# Altium schematic sheet Main.SchDoc
size B; SheetNumber: 3; SheetTotal: 3
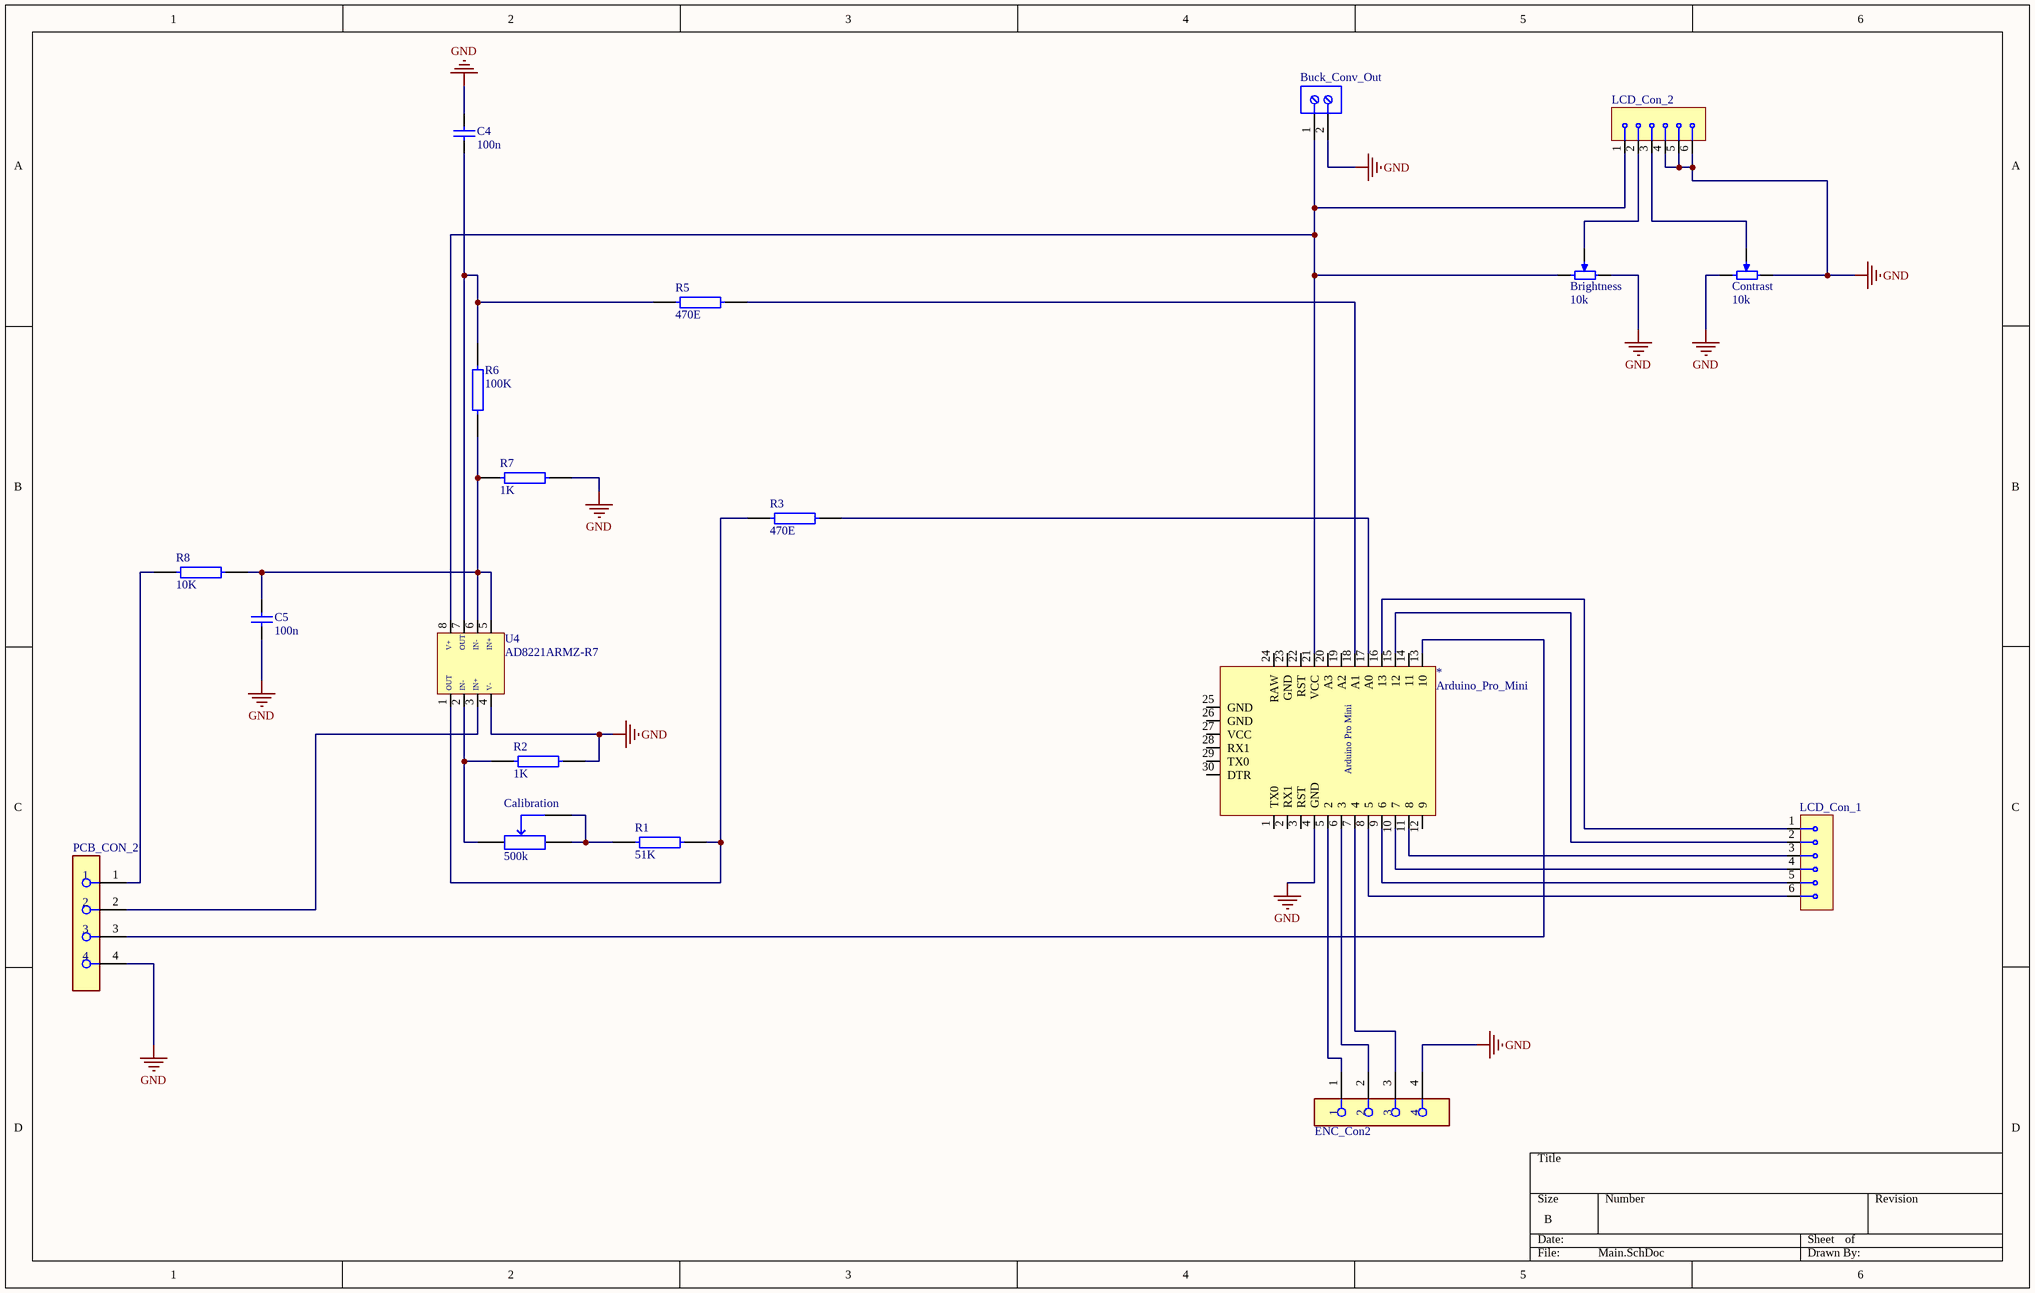
[diagram p0: Main.SchDoc]

## Parts
*  Arduino_Pro_Mini  [Arduino_Mini_Pro]
Brightness  10k  [10k_Trim_Pot]
Buck_Conv_Out  (no value)  [screw_terminal]
C4  100n  [Capacitor_Monolitoc]
C5  100n  [Capacitor_Monolitoc]
Calibration  500k  [500k_Trim_Pot]
Contrast  10k  [10k_Trim_Pot]
ENC_Con2  (no value)  [Header-Female-JST_4pin]
LCD_Con_1  (no value)  [6Pin_Connector]
LCD_Con_2  (no value)  [6Pin_Connector]
PCB_CON_2  (no value)  [Header-Female-JST_4pin]
R1  51K  [Resistor]
R2  1K  [Resistor]
R3  470E  [Resistor]
R5  470E  [Resistor]
R6  100K  [Resistor]
R7  1K  [Resistor]
R8  10K  [Resistor]
U4  AD8221ARMZ-R7  [DIP8_AD822]

## Nets
GND: *.4(GND) Brightness.1(CCW) Buck_Conv_Out.2 C4.2 C5.1 Contrast.1(CCW) Contrast.3(CW) ENC_Con2.4 LCD_Con_2.4 LCD_Con_2.5 LCD_Con_2.6 PCB_CON_2.4 R2.2 R7.2 U4.4
Net*_5: *.5(2) ENC_Con2.1
Net*_6: *.6(3) ENC_Con2.2
Net*_7: *.7(4) ENC_Con2.3
Net*_8: *.8(5) LCD_Con_1.6
Net*_9: *.9(6) LCD_Con_1.5
Net*_10: *.10(7) LCD_Con_1.4
Net*_11: *.11(8) LCD_Con_1.3
Net*_13: *.13(10) PCB_CON_2.3
Net*_15: *.15(12) LCD_Con_1.2
Net*_16: *.16(13) LCD_Con_1.1
Net*_17: *.17(A0) R3.2
Net*_18: *.18(A1) R5.2
Net*_21: *.21(VCC) Brightness.3(CW) Buck_Conv_Out.1 LCD_Con_2.1 U4.8
NetBrightness_2: Brightness.2(S) LCD_Con_2.2
NetC4_1: C4.1 R5.1 R6.2 U4.7
NetC5_2: C5.2 R6.1 R7.1 R8.2 U4.5 U4.6
NetCalibration_1: Calibration.1(CCW) Calibration.2(WIPER) R1.1
NetCalibration_3: Calibration.3(CW) R2.1 U4.2
NetContrast_2: Contrast.2(S) LCD_Con_2.3
NetPCB_CON_2_1: PCB_CON_2.1 R8.1
NetPCB_CON_2_2: PCB_CON_2.2 U4.3
NetR1_2: R1.2 R3.1 U4.1

Not connected (* = marked no-connect by the designer): * 1(TX0) 2(RX1) 3(RST) 12(9) 14(11) 19(A2) 20(A3) 22(RST) 23(GND) 24(RAW) 25(GND) 26(GND) 27(VCC) 28(RX1) 29(TX0) 30(DTR)

## Notes on the sheet
- (in symbol Arduino_Pro_Mini) Arduino Pro Mini
- (in symbol OP_AMP_AD822) V+; OUT; IN-; IN+; V-

## Library data of the parts
Brightness Contrast = 10k_Trim_Pot: Voltage Rating: 220 mV; Power Rating: 1 W; Tolerance: 1%; Resistance: 50 mohm; Case/Package: 1206; Length: 3.2 mm; RoHSCompliant: True; PackageDescription: 3-Pin Through Hole Device, Body 6.6 x 6.99 mm, Pitch 2.54 mm; ComponentLink2Description: Datasheet; REACH SVHC: No SVHC; Mount: Surface Mount; Height: 0.6 mm; Packaging: Tape and Reel; ComponentLink1URL: http://www.bourns.com/; Case Code (Imperial): 0612; Pins: 2; Case Code (Metric): 1632; ComponentLink2URL: http://www.bourns.com/docs/Product-Datasheets/3362.pdf; Min Operating Temperature: -25degC; ComponentLink1Description: Manufacturer URL; PackageReference: 3326P; Max Operating Temperature: 125degC; Width: 1.6 mm; Package Quantity: 5000; DatasheetVersion: May-16
Buck_Conv_Out = Screw_Terminal: NexarPartId: 18818288; Plating: Brass, Steel; Current: 10A; Pitch: 3.5052mm; Number of Levels: 1; Number of Contacts: 2; Wire Gauge (Min): 16AWG; Voltage: 300V; Wire Gauge (Max): 24AWG; Stripping Length: -6mm; Number of Pins: 2; Number of Rows: 1; REACH SVHC: Unknown; RoHS: Compliant; Housing Material: Nylon; Termination: Screw; Mount: Through Hole; Contact Plating: Brass, Tin; Number of Positions Per Level: 2; Color: Blue, Green; Width: 7.9mm; Voltage Rating: 300V; Length: 7.4mm; Current Rating: 10A; Wire/Cable Gauge: 24AWG; Packaging: Box; Max Operating Temperature: 105°C; Lead Pitch: 3.5mm; Height: 8.7mm; Contact Material: Brass; Min Operating Temperature: -40°C
C4 C5 = Capacitor_Monolitic: Manufacturer: Murata; Packaging type: Bulk; CS: 5mm; Tolerance: 10%; Capacity (elec.): 10nF; Material: Ceramic; Type: radiallead; Industrial packaging: Yes; Nominal voltage: 1000V; Content: 500pc(s); Category: Ceramiccapacitor; Datasheet Version: 06/2016; Package Reference: DEBF33A103ZA2B; Mounting Technology: ThroughHole; Package Description: 2-Pin Through Hole Device, Body 4 x 10 mm, Pitch 5 mm; Datasheet URL: http://psearch.en.murata.com/capacitor/product/DEBF33A103ZA2B.pdf; Manufacturer URL: http://www.murata.com/
Calibration = 500k_Trim_Pot: TRIMMER 500K OHM 0.5W PC PIN TOP; Manufacturer: Bourns; Manufacturer Part Number: 3296W-1-504LF; Resistance: 500kΩ; Temperature Coefficient: 100ppm/°C; Value: 500kΩ; Tolerance: 10%; Voltage Rating: 300V; Standoff Height: 0.38mm; ComponentLink2Description: Datasheet; Package: 3296W; Series: Trimpot 3296-Sealed; Lead Free: Yes; Octopart: https://octopart.com/3296w-1-504lf-bourns-143884; Device Class L2: Resistors; Automotive: No; RoHS: TRUE; Temperature Range High: +125°C; Height: 12.05mm; Power Rating: 0.5W; Temperature Range Low: -55°C; ComponentLink2URL: https://www.bourns.com/docs/Product-Datasheets/3296.pdf; Device Class L1: Passive Components; Device Class L3: Variable Resistors and Potentiometers; Category: Res; Temperature: -55°C to +125°C; Digikey Description: TRIMMER 500K OHM 0.5W PC PIN TOP; Mouser Description: Trimmer; Cermet; Rest 500 Kilohms; PCB; 25 Turns; Pwr-Rtg 0.5W
ENC_Con2 PCB_CON_2 = Header-Female-JST_4pin: Contact Resistance: 10mR; Number of Positions: 4; Pitch: 2.54mm; Gender: Female; Connector Type: Receptacle; Max Current Rating: 1A; Color: Black; Contact Material: Copper; Min Operating Temperature: -55°C; Max Operating Temperature: 125°C; Radiation Hardening: No; Termination: Solder; Depth: 2.54mm; Contact Plating: Gold; Orientation: Straight; Housing Color: Black; Width: 2.54mm; RoHS Compliant: Yes; Lead Free: Lead Free; Mount: Through Hole; Series: SS; Length: 10.16mm; Packaging: Bulk; Package Quantity: 1; Housing Material: Polyester; Number of Contacts: 4; Number of Rows: 1
LCD_Con_1 LCD_Con_2 = 6Pin_Connector
R1-R3 R5-R8 = Resistor: NexarPartId: 44386654; Tolerance: 1%; Max Power Dissipation: 250mW; Voltage Rating: 200V; Power Rating: 125mW; Temperature Coefficient: 50ppm/°C; Resistance: 73.2kΩ; Width: 1.65mm; Length: 3.81mm; Schedule B: 8533210090, 8533210090|8533210090|8533210090|8533210090|8533210090; Termination: Axial; Lead Free: Lead Free; Diameter: 1.65mm; Voltage Rating (DC): 200V; Packaging: Cut Tape; Max Operating Temperature: 175°C; Composition: Metal Film; RoHS: Compliant; Mount: Through Hole; Features: Flame Retardant Coating, Moisture Resistant; Number of Terminations: 2; Min Operating Temperature: -55°C; Case/Package: Axial
U4 = OP_AMP_AD822: Manufacturer: Analog Devices; Packing: Tape and Reel; -3dB Bandwidth@G: 1=825 kHz; VIO: 60 uV Max.; Quiescent Current: 0.9 mA Typ.; Slew Rate@G: 1=2 V/us Typ.; PartNumber: AD8221ARMZ-R7; ComponentLink3Description: Package Specification; PackageVersion: Aug-05; Temperature Range: -40 to 125 degC; RoHS: TRUE; ComponentLink3URL: http://www.analog.com/static/imported-files/packages/PKG_PDF/MSOP(RM)/RM_8.pdf; PackageDescription: 8-Pin Mini Small Outline Package, Body 3 x 3 mm, Pitch 0.65 mm; ComponentLink1URL: http://www.analog.com/en/index.html; ComponentLink2URL: http://www.analog.com/static/imported-files/data_sheets/AD8221.pdf; ComponentLink2Description: Datasheet; ComponentLink1Description: Manufacturer URL; DatasheetVersion: Rev. C; Mounting Technology: Surface Mount